# EAGLE design RFID_System_Board (EAGLE 8.3.2)
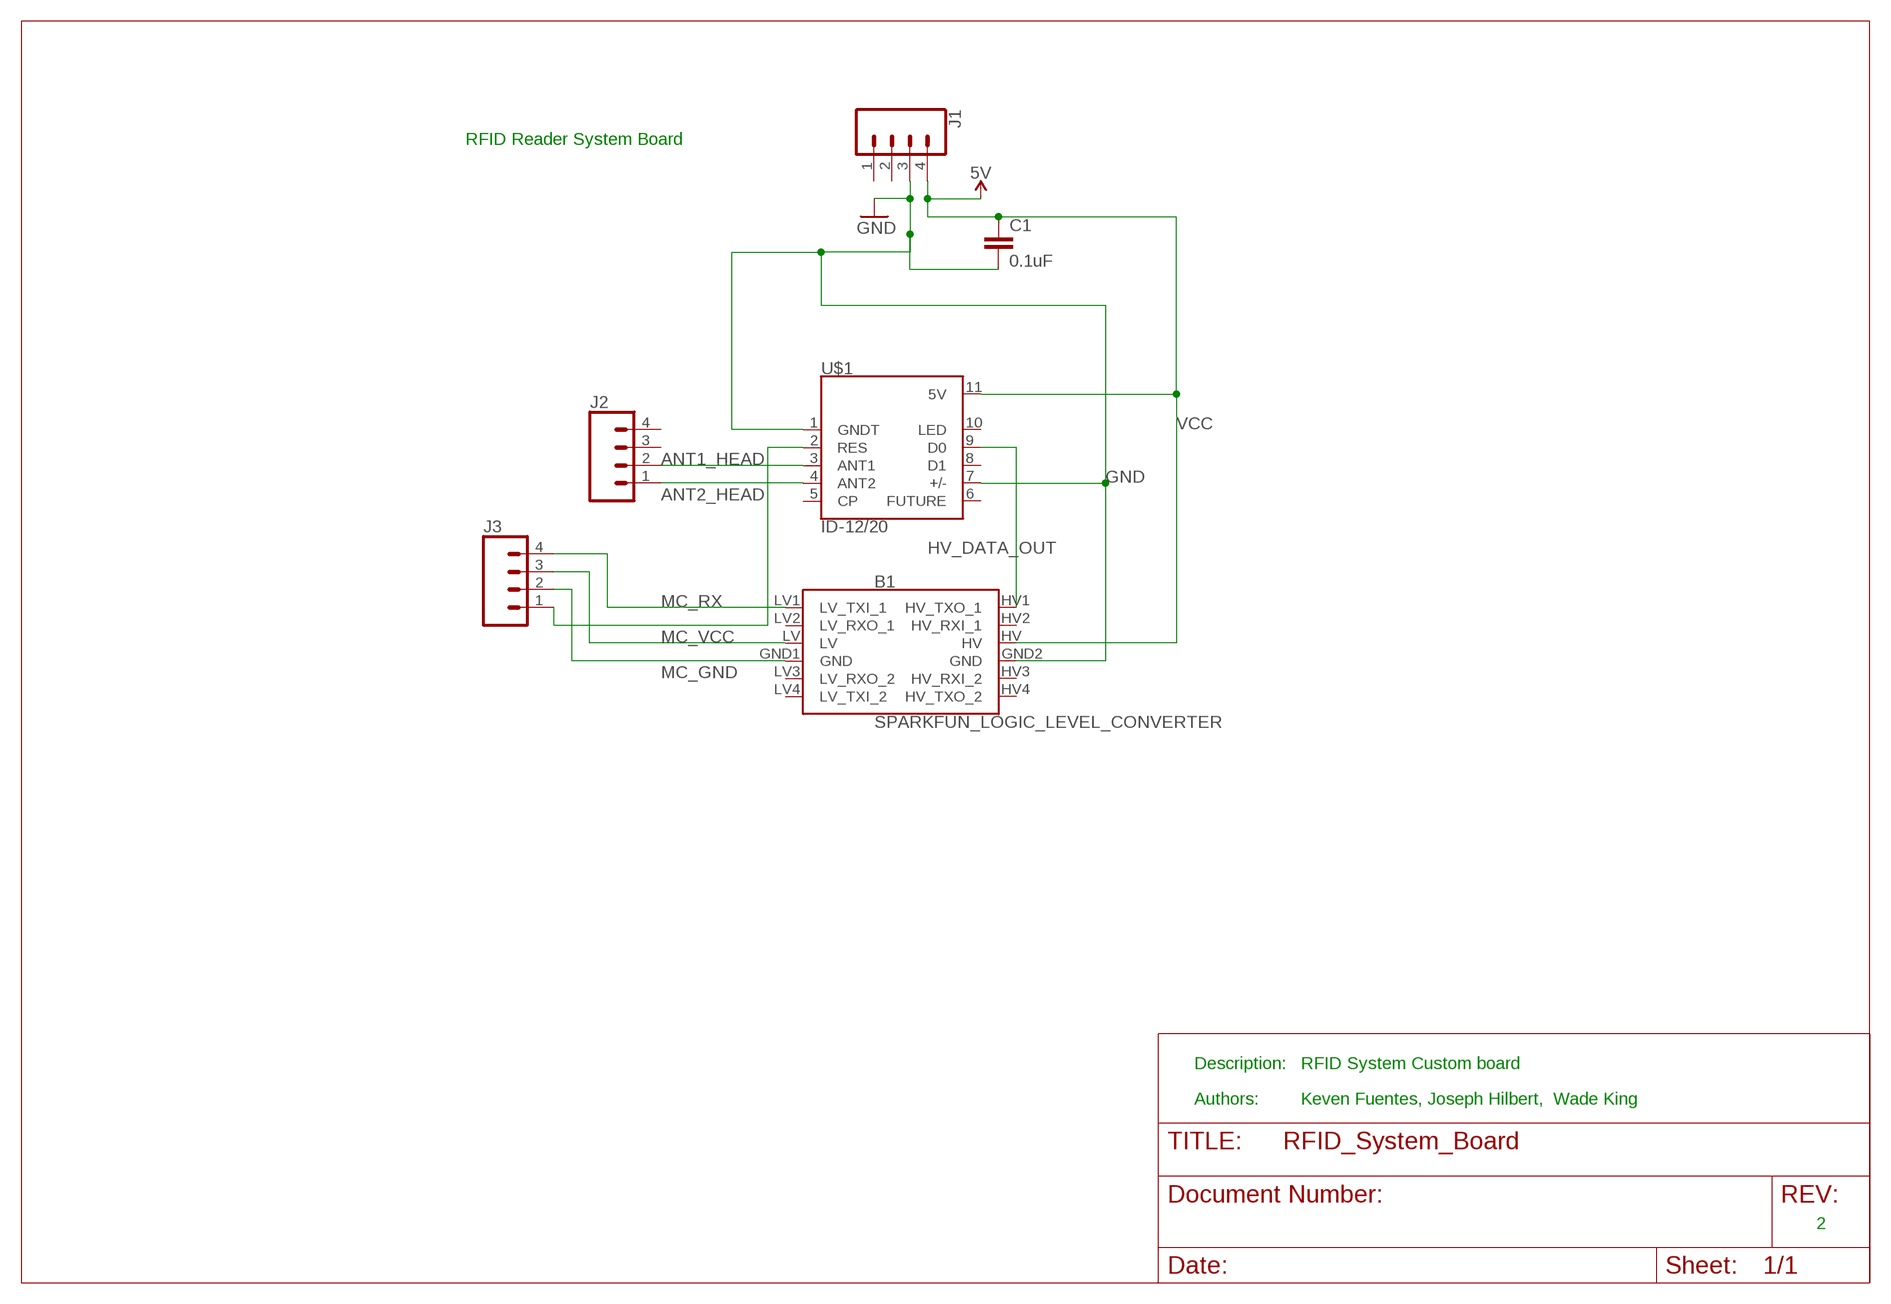
[diagram p0: schematic, sheet 1]

## Parts
B1  SPARKFUN_LOGIC_LEVEL_CONVERTER  [SPARKFUN_LOGIC_LEVEL_CONVERTER]
C1  0.1uF  0.1UF-0603-25V-(+80/-20%)  [0603]
J1  CONN_04  [1X04]
J2  CONN_04  [1X04]
J3  CONN_04  [1X04]
U$1  ID-12/20  [ID-12]

## Nets
ANT1_HEAD: J2.2 U$1.3(ANT1)
ANT2_HEAD: J2.1 U$1.4(ANT2)
GND: B1.GND2(GND) C1.2 J1.3 U$1.1(GNDT) U$1.7(+/-)
HV_DATA_OUT: B1.HV1(HV_TXO_1) U$1.9(D0)
MC_GND: B1.GND1(GND) J3.2
MC_RX: B1.LV1(LV_TXI_1) J3.4
MC_VCC: B1.LV J3.3
N$1: J3.1 U$1.2(RES)
VCC: B1.HV C1.1 J1.4 U$1.11(5V) ; supply symbol labelled 5V
Unconnected: B1.HV2(HV_RXI_1) B1.HV3(HV_RXI_2) B1.HV4(HV_TXO_2) B1.LV2(LV_RXO_1) B1.LV3(LV_RXO_2) B1.LV4(LV_TXI_2) J1.1 J1.2 J2.3 J2.4 U$1.5(CP) U$1.6(FUTURE) U$1.8(D1) U$1.10(LED)

## Notes on the sheet
- RFID Reader System Board
- Description: | RFID System Custom board
- Authors: | Keven Fuentes, Joseph Hilbert,  Wade King
- 2

## Library data of the parts
B1 = SparkFun-Boards:SPARKFUN_LOGIC_LEVEL_CONVERTER: SparkFun Logic Level Converter -Bi-Directional This is the mechnical outline for the 3.3V - 5V bi directional logic level converter. *Note, the "LOCK" Package has the header pins staggered by an offset of 5 mils (off center line), so that when you slide a row of standard 0.1" headers into the PTH pads, it will hold position vertically. See the follwing turorial for more information on this type of special footprints: Sneaky Footprints <https://www.sparkfun.com/tutorials/114> SparkFun Products: SparkFun Logic Level Converter - Bi-Directional <https://www.sparkfun.com/products/12009>
C1 = SparkFun-Capacitors:0.1UF: 0.1µF ceramic capacitors A capacitor is a passive two-terminal electrical component used to store electrical energy temporarily in an electric field.; PROD_ID: CAP-00810
J1-J3 = SparkFun-Connectors:CONN_04: Multi connection point. Often used as Generic Header-pin footprint for 0.1 inch spaced/style header connections On any of the 0.1 inch spaced packages, you can populate with these: Break Away Headers - Straight <https://www.sparkfun.com/products/116> (PRT-00116) Break Away Male Headers - Right Angle <https://www.sparkfun.com/products/553> (PRT-00553) Female Headers <https://www.sparkfun.com/products/115> (PRT-00115) Break Away Headers - Machine Pin <https://www.sparkfun.com/products/117> (PRT-00117) Break Away Female Headers - Swiss Machine Pin <https://www.sparkfun.com/products/743> (PRT-00743) For SCREWTERMINALS and SPRING TERMINALS visit here: Screw Terimnals on SparkFun.com <https://www.sparkfun.com/search/results?term=Screw+Terminals> (5mm/3.5mm/2.54mm spacing) This device is also useful as a general connection point to wire up your design to another part of your project. Our various solder wires solder well into these plated through hole pads. Hook-Up Wire - Assortment (Stranded, 22 AWG) <https://www.sparkfun.com/products/11375> (PRT-11375) Hook-Up Wire - Assortment (Solid Core, 22 AWG) <https://www.sparkfun.com/products/11367> (PRT-11367) View the entire wire category on our website here <https://www.sparkfun.com/categories/141> Special notes: Molex polarized connector foot print use with SKU : PRT-08231 with associated crimp pins and housings. 1MM SMD Version SKU: PRT-10208; PROD_ID: CONN-09696
U$1 = SparkFun-RF:ID-12/20: ID Innovations 125kHz RFID Reader (ID2, ID3, ID12, and ID20) The IDS, ID3, ID12, and ID20 are very simple to use RFID reader modules. Power the module, hold up a 125kHz card, and get a serial string output containing the unique ID of the card. SparkFun Products RFID Reader ID-3LA (125 kHz) <https://www.sparkfun.com/products/11862> (SEN-11862) RFID Reader ID-12LA (125 kHz) <https://www.sparkfun.com/products/11827> (SEN-11827) RFID Reader ID-20LA (125 kHz) <https://www.sparkfun.com/products/11828> (SEN-11828) SparkFun RFID USB Reader <https://www.sparkfun.com/products/9963> (SEN-9963); PROD_ID: CONN-08875

## Board
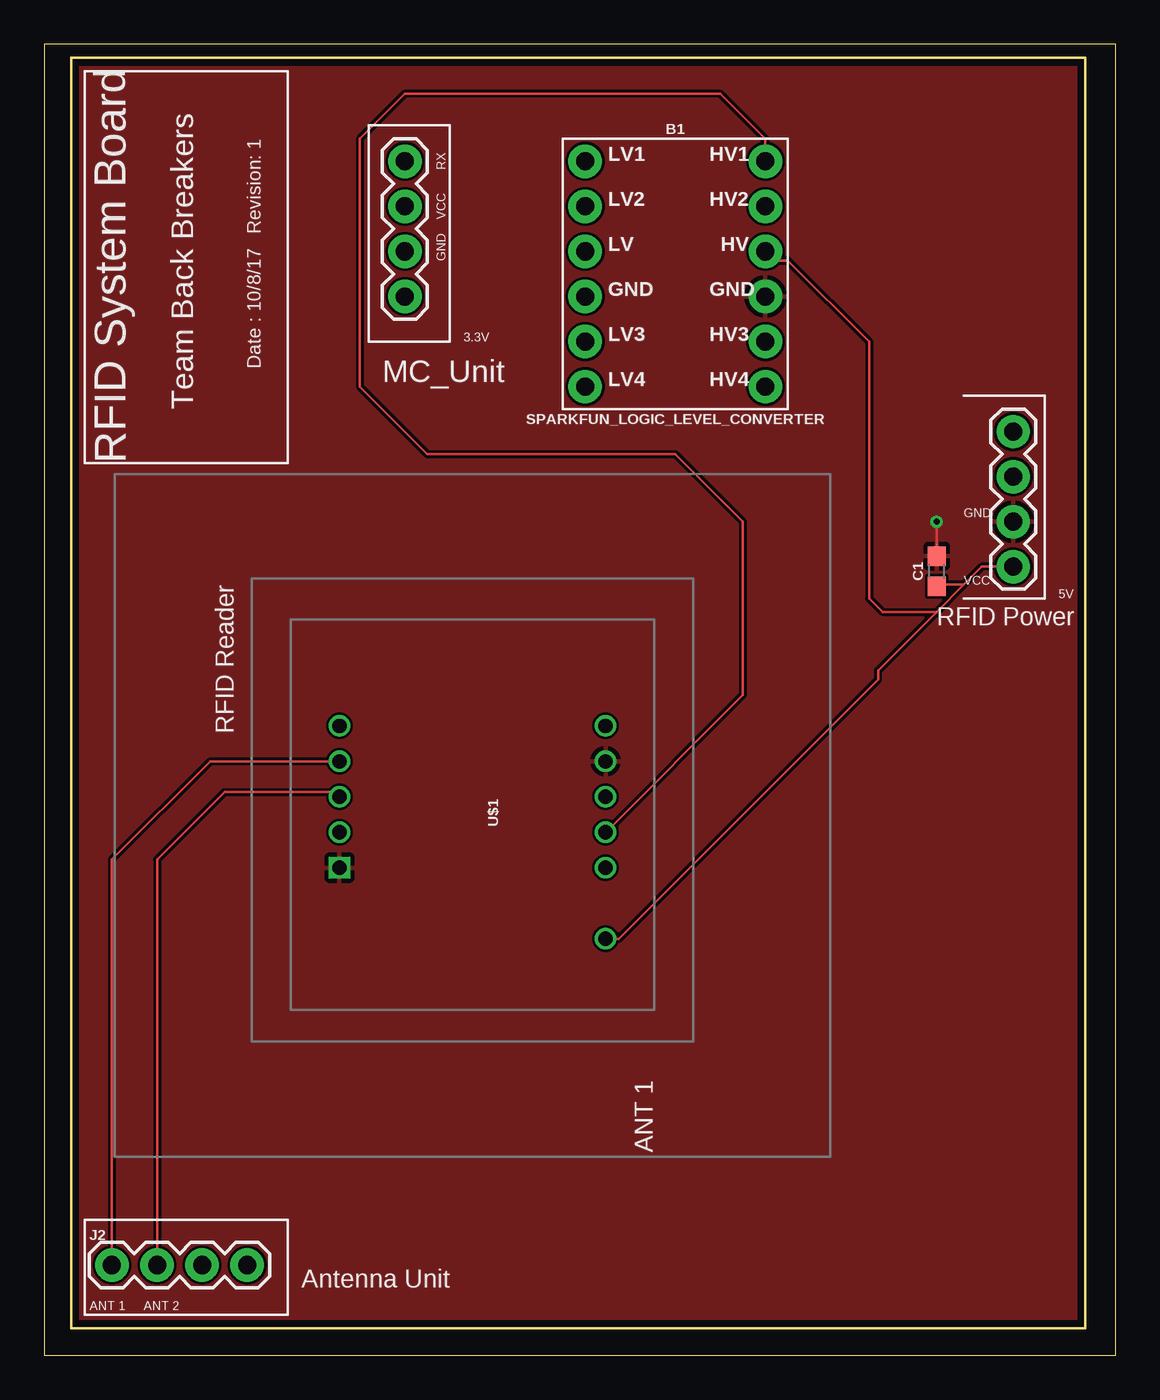
[diagram p1: board, top side]
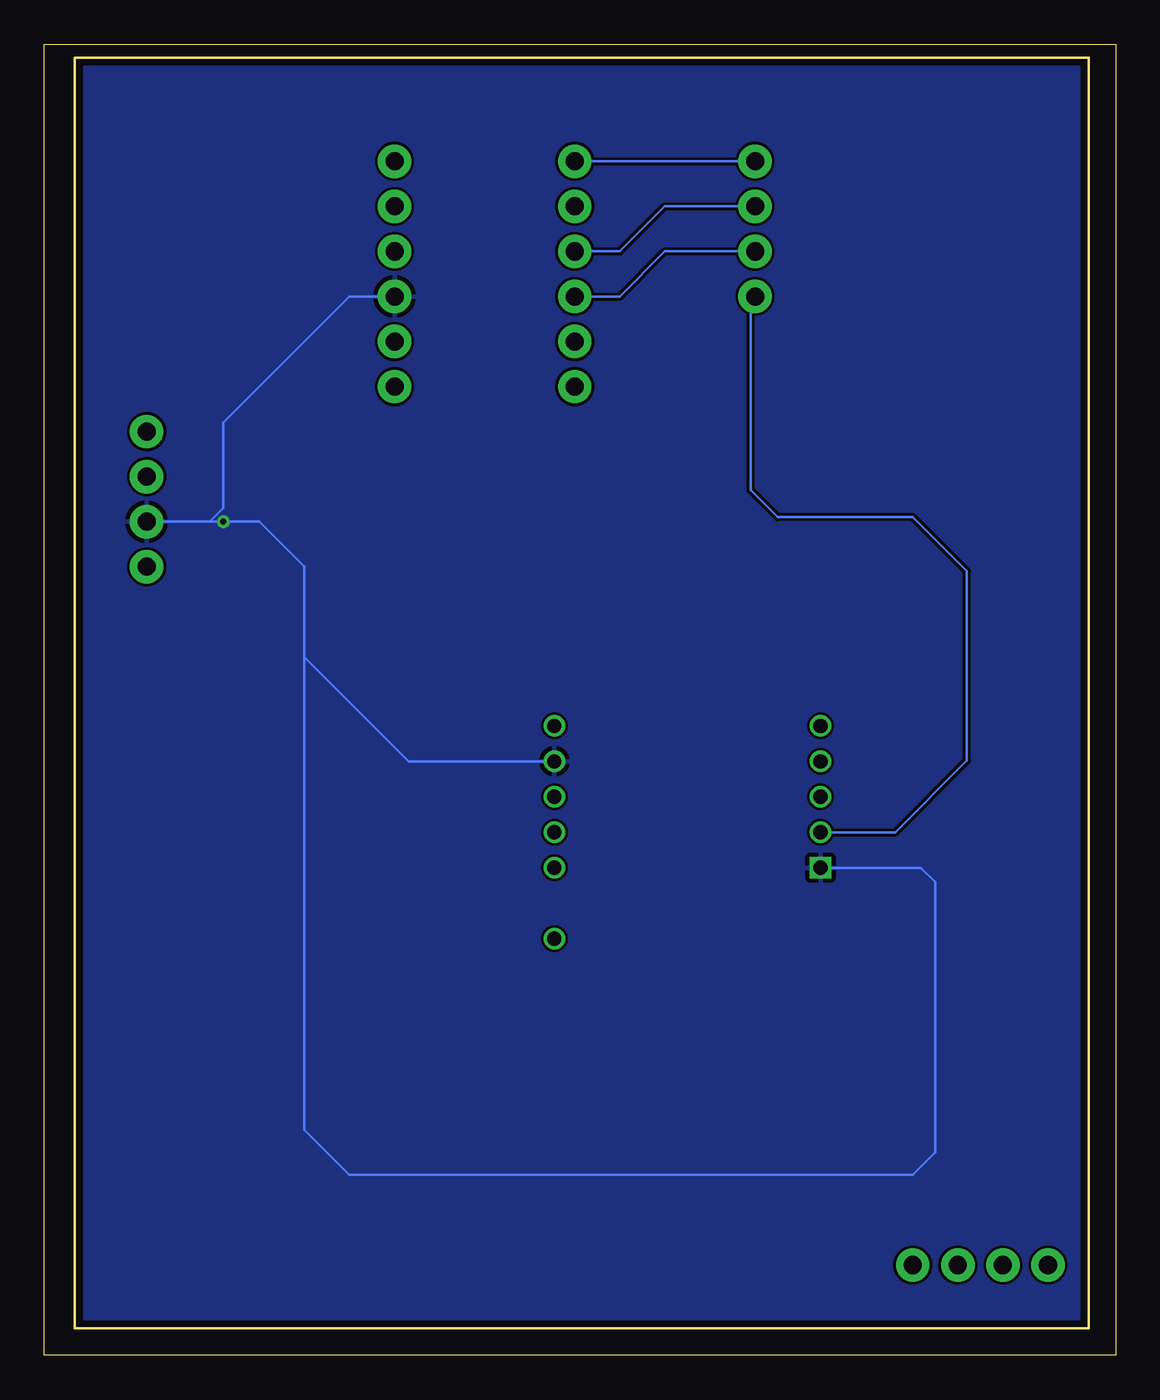
[diagram p2: board, bottom side, seen from below]

Size 60.38 x 73.9 mm. Coordinates in mm from the lower left corner, seen from the top.
Outline: 0,0 60.38,0 60.38,73.9 0,73.9 0,0
Outline: 1.52,1.52 1.52,73.15 58.67,73.15 58.67,1.52 1.52,1.52
Copper layers (1*16): Top 0.0356mm / dielectric 1.5011mm / Bottom 0.0356mm
Design rules "oshpark-2layer": minimum track width 6mil, minimum drill 13mil, track to track 6mil, track to pad 6mil, pad to pad 6mil, via to via 6mil, smd to smd 6mil, copper to edge 15mil, drill to drill 6mil, minimum pad ring 7mil, minimum via ring 7mil, stop-mask expansion 2.5mil, vias tented up to drill 0mil, thermal gap 10mil

### Footprints (pad centres in the part's own frame; a part is rotated, then mirrored left to right if it is on the bottom)
SPARKFUN_LOGIC_LEVEL_CONVERTER = drill 1.016 pad 1.88: GND1 -5.08,-1.27; GND2 5.08,-1.27; HV 5.08,1.27; HV1 5.08,6.35; HV2 5.08,3.81; HV3 5.08,-3.81; HV4 5.08,-6.35; LV -5.08,1.27; LV1 -5.08,6.35; LV2 -5.08,3.81; LV3 -5.08,-3.81; LV4 -5.08,-6.35
0603 = smd 1.1 x 1: 1 -0.85,0; 2 0.85,0
1X04 = drill 1.016 pad 1.88: 1 0,0; 2 2.54,0; 3 5.08,0; 4 7.62,0
ID-12 = drill 0.8 square: 1 3,-7.5 | drill 0.8: 2 1,-7.5; 3 -1,-7.5; 4 -3,-7.5; 5 -5,-7.5; 6 -5,7.5; 7 -3,7.5; 8 -1,7.5; 9 1,7.5; 10 3,7.5; 11 7,7.5

### Placement (x,y rotation side)
B1  35.56,60.96 0 top
C1  50.29,44.2 90 top
J1  54.61,52.07 270 top
J2  3.81,5.08 0 top
J3  20.32,59.69 90 top
U$1  24.13,30.48 270 top

### Tracks (layer width: path | path; a pad name or v marks a point on that pad's centre or on a via)
ANT1_HEAD
  Top 0.152: U$1.3 16.36,31.75 10.16,31.75 6.35,27.94 J2.2
ANT2_HEAD
  Top 0.152: U$1.4 9.35,33.48 3.81,27.94 J2.1
GND  (via drill 0.35)
  Top 0.152: C1.2 v50.29,46.99
  Bottom 0.152: U$1.1 10.97,27.48 10.16,26.67 10.16,11.43 11.43,10.16 43.18,10.16 45.72,12.7 45.72,39.37 | 45.72,39.37 45.72,44.45 48.26,46.99 v50.29,46.99 51.05,46.99 | B1.GND2 43.18,59.69 50.29,52.58 50.29,47.75 51.05,46.99 | U$1.7 39.83,33.48 45.72,39.37 | J1.3 51.05,46.99
  pour Bottom: 1.52,73.15 58.67,73.15 58.67,1.52 1.52,1.52
  pour Top: 1.52,73.15 58.67,73.15 58.67,1.52 1.52,1.52
HV_DATA_OUT
  Top 0.152: B1.HV1 40.64,68.58 38.1,71.12 20.32,71.12 17.78,68.58 17.78,54.61 21.59,50.8 35.56,50.8 39.37,46.99 39.37,37.22 U$1.9
MC_GND
  Bottom 0.152: B1.GND1 27.94,59.69 25.4,62.23 J3.2
MC_RX
  Bottom 0.152: B1.LV1 J3.4
MC_VCC
  Bottom 0.152: B1.LV 27.94,62.23 25.4,64.77 J3.3
N$1
  Bottom 0.152: U$1.2 12.43,29.48 8.38,33.53 8.38,44.2 11.43,47.24 19.05,47.24 20.57,48.77 20.57,59.44 J3.1
VCC
  Top 0.152: U$1.11 32.37,23.48 46.99,38.1 46.99,38.61 50.29,41.91 | B1.HV 41.15,61.72 41.91,61.72 46.48,57.15 46.48,42.67 47.24,41.91 50.29,41.91 | J1.4 52.83,44.45 51.82,43.43 | 51.82,43.43 50.38,43.43 C1.1 | 50.29,41.91 51.82,43.43

### Text on the board
tNames: Revision: 1 | RX | VCC | GND | 3.3V | Date : 10/8/17 | MC_Unit | Team Back Breakers | RFID System Board | GND | VCC | 5V | RFID Power | RFID Reader | ANT 1 | Antenna Unit | ANT 1 | ANT 2